# EAGLE design DAC_GainOutputStage6 (EAGLE 9.6.2)
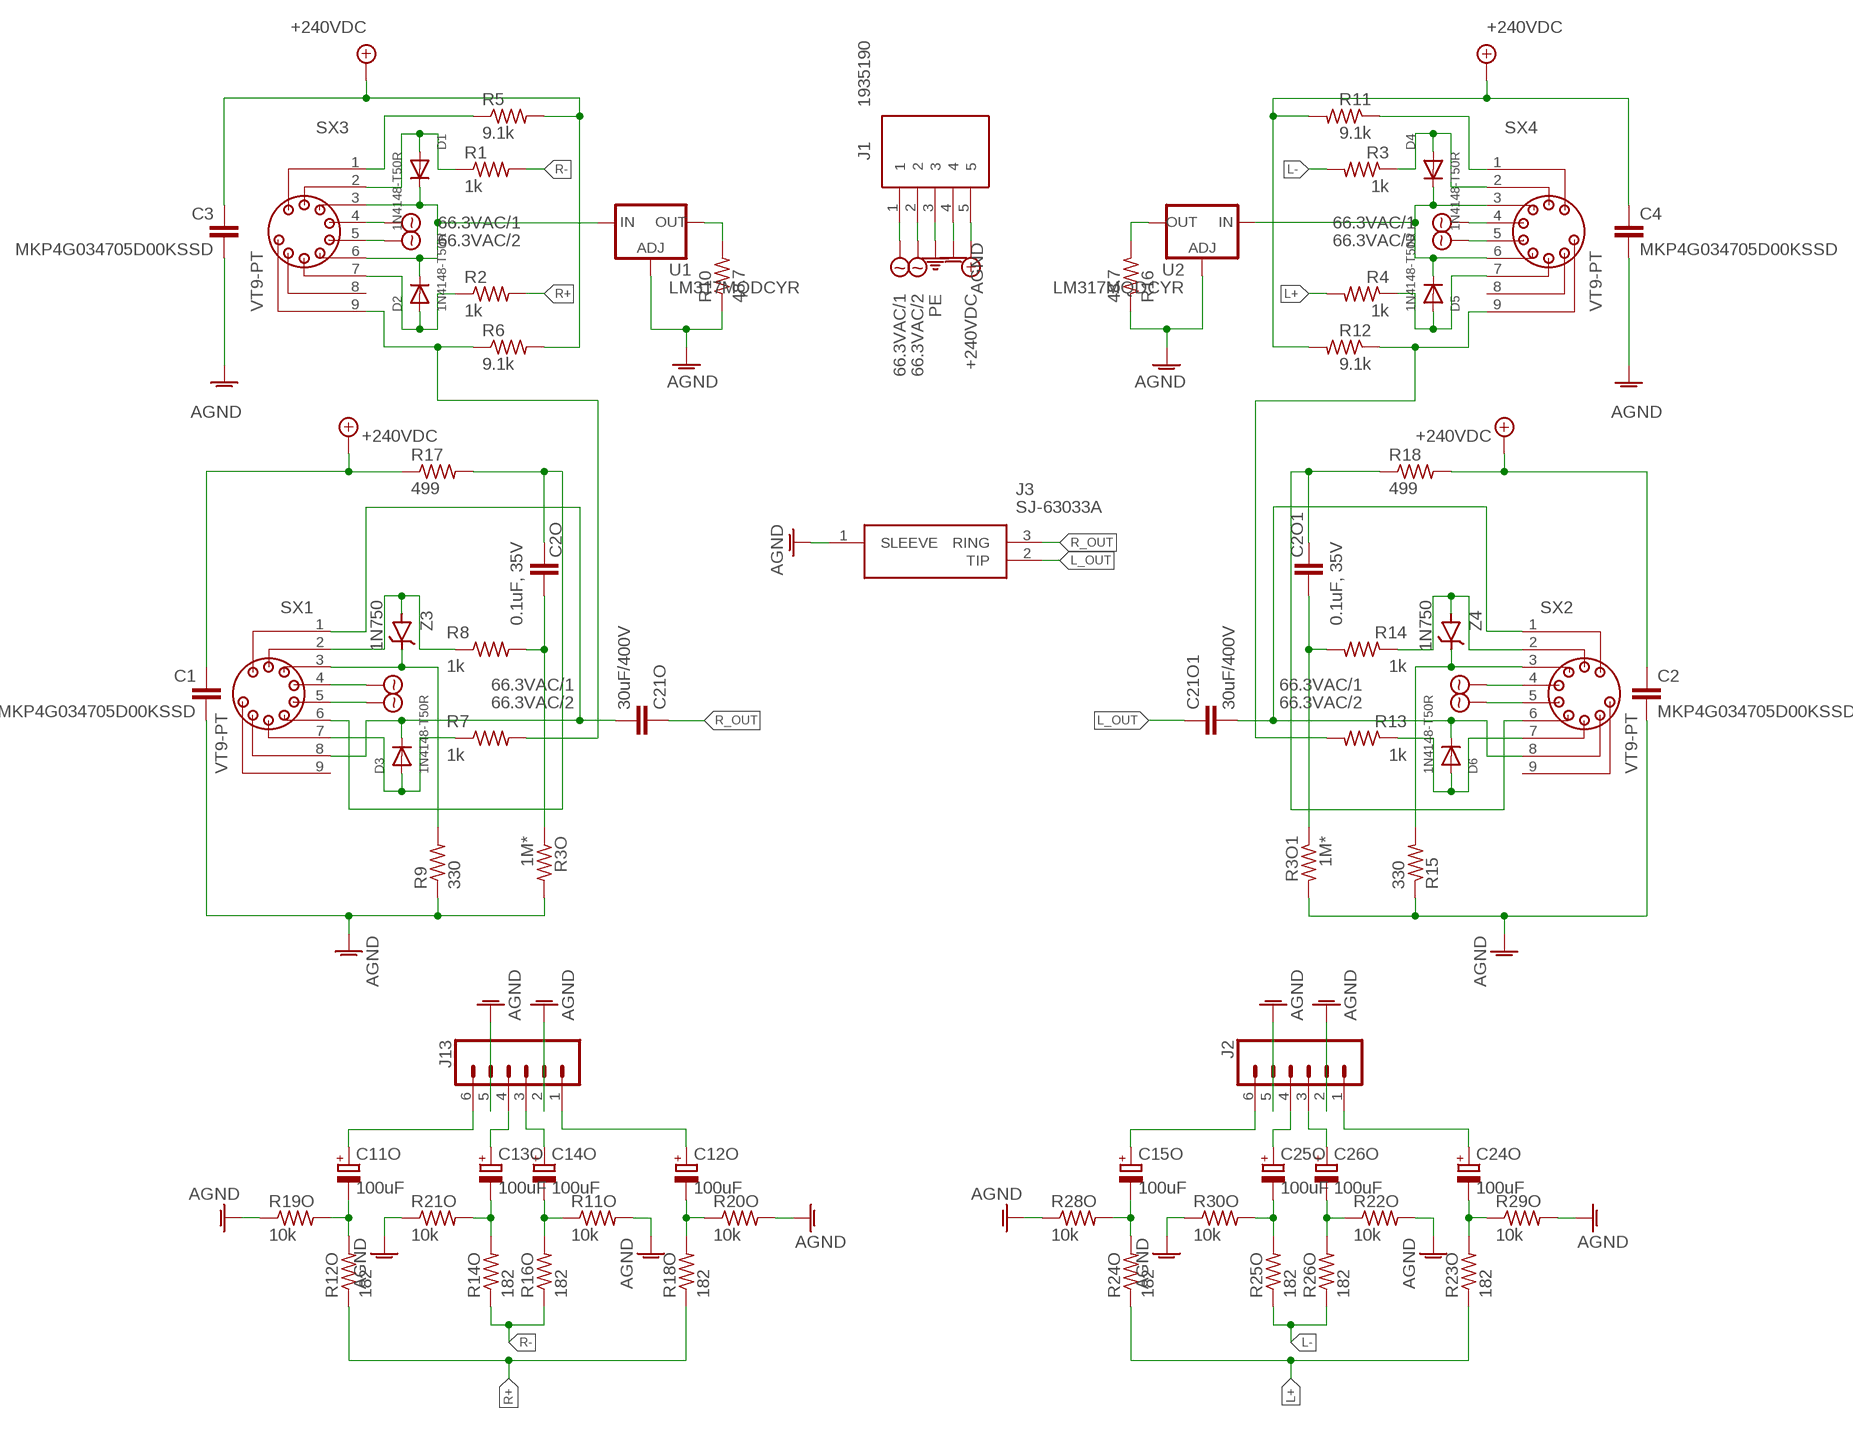
[diagram p0: schematic, sheet 1]

## Parts
C1  MKP4G034705D00KSSD  [MKP4G034705D00KSSD]
C2  MKP4G034705D00KSSD  [MKP4G034705D00KSSD]
C2O  0.1uF, 35V  MKS4B031002A00JC00  [MKS4B031002A00JC00]
C2O1  0.1uF, 35V  MKS4B031002A00JC00  [MKS4B031002A00JC00]
C3  MKP4G034705D00KSSD  [MKP4G034705D00KSSD]
C4  MKP4G034705D00KSSD  [MKP4G034705D00KSSD]
C11O  100uF  UFW1H101MPD1TD  [CAPPRD350W60D825H1300]
C12O  100uF  UFW1H101MPD1TD  [CAPPRD350W60D825H1300]
C13O  100uF  UFW1H101MPD1TD  [CAPPRD350W60D825H1300]
C14O  100uF  UFW1H101MPD1TD  [CAPPRD350W60D825H1300]
C15O  100uF  UFW1H101MPD1TD  [CAPPRD350W60D825H1300]
C21O  30uF/400V  DCP4G053006ID2KSSD  [DCP4G053006ID2KSSD]
C21O1  30uF/400V  DCP4G053006ID2KSSD  [DCP4G053006ID2KSSD]
C24O  100uF  UFW1H101MPD1TD  [CAPPRD350W60D825H1300]
C25O  100uF  UFW1H101MPD1TD  [CAPPRD350W60D825H1300]
C26O  100uF  UFW1H101MPD1TD  [CAPPRD350W60D825H1300]
D1  1N4148-T50R  [DIOAD1068W53L380D172]
D2  1N4148-T50R  [DIOAD1068W53L380D172]
D3  1N4148-T50R  [DIOAD1068W53L380D172]
D4  1N4148-T50R  [DIOAD1068W53L380D172]
D5  1N4148-T50R  [DIOAD1068W53L380D172]
D6  1N4148-T50R  [DIOAD1068W53L380D172]
J1  1935190  [1935190]
J2  CONN_06SILK_FEMALE_PTH  [1X06]
J3  SJ-63033A  [SJ63033A]
J13  CONN_06SILK_FEMALE_PTH  [1X06]
R1  1k  LR1F1K0  [0207/10]
R2  1k  LR1F1K0  [0207/10]
R3  1k  LR1F1K0  [0207/10]
R3O  1M*  LR1F1M0  [0207/10]
R3O1  1M*  LR1F1M0  [0207/10]
R4  1k  LR1F1K0  [0207/10]
R5  9.1k  PR02000209101FA100  [0411/15]
R6  9.1k  PR02000209101FA100  [0411/15]
R7  1k  LR1F1K0  [0207/10]
R8  1k  LR1F1K0  [0207/10]
R9  330  LR1F330R  [0207/10]
R10  48.7  RN55D48R7FB14  [0207/10]
R11  9.1k  PR02000209101FA100  [0411/15]
R11O  10k  LR1F10K  [0207/10]
R12  9.1k  PR02000209101FA100  [0411/15]
R12O  182  MF0207FTE52-182R  [0207/10]
R13  1k  LR1F1K0  [0207/10]
R14  1k  LR1F1K0  [0207/10]
R14O  182  MF0207FTE52-182R  [0207/10]
R15  330  LR1F330R  [0207/10]
R16  48.7  RN55D48R7FB14  [0207/10]
R16O  182  MF0207FTE52-182R  [0207/10]
R17  499  PR02000204990FA100  [0411/15]
R18  499  PR02000204990FA100  [0411/15]
R18O  182  MF0207FTE52-182R  [0207/10]
R19O  10k  LR1F10K  [0207/10]
R20O  10k  LR1F10K  [0207/10]
R21O  10k  LR1F10K  [0207/10]
R22O  10k  LR1F10K  [0207/10]
R23O  182  MF0207FTE52-182R  [0207/10]
R24O  182  MF0207FTE52-182R  [0207/10]
R25O  182  MF0207FTE52-182R  [0207/10]
R26O  182  MF0207FTE52-182R  [0207/10]
R28O  10k  LR1F10K  [0207/10]
R29O  10k  LR1F10K  [0207/10]
R30O  10k  LR1F10K  [0207/10]
SX1  VT9-PT  [VT9-PT]
SX2  VT9-PT  [VT9-PT]
SX3  VT9-PT  [VT9-PT]
SX4  VT9-PT  [VT9-PT]
U1  LM317MQDCYR  [SOT230P700X180-4N]
U2  LM317MQDCYR  [SOT230P700X180-4N]
Z3  1N750  [DIOAD1256W56L444D203]
Z4  1N750  [DIOAD1256W56L444D203]

## Nets
66.3VAC/1 [Power]: J1.1 SX1.4 SX2.4 SX3.4 SX4.4
66.3VAC/2 [Power]: J1.2 SX1.5 SX2.5 SX3.5 SX4.5
+240VDC [Power]: C1.1 C2.1 C3.1 C4.1 J1.5 R5.2 R6.2 R11.2 R12.2 R17.1 R18.2
AGND [Power]: C1.2 C2.2 C3.2 C4.2 J1.4 J2.2 J2.5 J3.1(SLEEVE) J13.2 J13.5 R3O1.2 R3O.2 R9.1 R10.1 R11O.2 R15.1 R16.1 R19O.1 R20O.2 R21O.1 R22O.2 R28O.1 R29O.2 R30O.1 U1.1(ADJ) U2.1(ADJ)
L+ [Signal]: R4.2 R23O.1 R24O.1
L- [Signal]: R3.2 R25O.1 R26O.1
L_OUT [Signal]: C21O1.1 J3.2(TIP)
N$1: R6.1 R7.2 SX3.9
N$2: R8.1 SX1.2 Z3.2(A)
N$3: C21O1.2 D6.1(C) SX2.1 SX2.8
N$4: D4.2(A) R3.1 SX4.2
N$5: D5.2(A) R4.1 SX4.7
N$6: D1.2(A) R1.1 SX3.2
N$7 [Power]: D4.1(C) D5.1(C) SX4.3 SX4.6 U2.3(IN)
N$8: R11.1 SX4.1
N$9: R12.1 R13.2 SX4.9
N$10: C11O.1(+) J13.6
N$11: C11O.2(-) R12O.2 R19O.2
N$12: C15O.1(+) J2.6
N$13: D2.2(A) R2.1 SX3.7
N$14: R14.1 SX2.2 Z4.2(A)
N$15: C12O.1(+) J13.1
N$16: C2O.2 R3O.1 R8.2
N$17: C2O1.2 R3O1.1 R14.2
N$18: C21O.2 D3.1(C) SX1.1 SX1.8
N$19: C12O.2(-) R18O.2 R20O.1
N$20: C15O.2(-) R24O.2 R28O.2
N$21: C13O.1(+) J13.4
N$22 [Power]: D1.1(C) D2.1(C) SX3.3 SX3.6 U1.3(IN)
N$23: D3.2(A) R7.1 SX1.7
N$24: C14O.1(+) J13.3
N$25: C14O.2(-) R11O.1 R16O.2
N$26: R9.2 SX1.3 Z3.1(C)
N$27: R15.2 SX2.3 Z4.1(C)
N$28: C13O.2(-) R14O.2 R21O.2
N$29: D6.2(A) R13.1 SX2.7
N$30: C24O.1(+) J2.1
N$31: C24O.2(-) R23O.2 R29O.1
N$32: C25O.1(+) J2.4
N$33: C26O.1(+) J2.3
N$34: C26O.2(-) R22O.1 R26O.2
N$35: R5.1 SX3.1
N$36: C25O.2(-) R25O.2 R30O.2
N$37: R10.2 U1.2(OUT) U1.4(OUT)
N$38: R16.2 U2.2(OUT) U2.4(OUT)
N$39 [Power]: C2O.1 R17.2 SX1.6
N$40 [Power]: C2O1.1 R18.1 SX2.6
PE [Power]: J1.3
R+ [Signal]: R2.2 R12O.1 R18O.1
R- [Signal]: R1.2 R14O.1 R16O.1
R_OUT [Signal]: C21O.1 J3.3(RING)
Unconnected: SX1.9 SX2.9 SX3.8 SX4.8

## Library data of the parts
C1-C4 = Dual Mono Amp Library:MKP4G034705D00KSSD: 0.47 F Film Capacitor 220V 400V Polypropylene (PP), Metallized Radial Source: Datasheet <https://www.wima.de/wp-content/uploads/media/e_WIMA_MKP_4.pdf>; DESCRIPTION: 0.47 F Film Capacitor 220V 400V Polypropylene (PP), Metallized Radial; HEIGHT: 16.5mm; MANUFACTURER_NAME: WIMA; MANUFACTURER_PART_NUMBER: MKP4G034705D00KSSD; MOUSER_PART_NUMBER: 505-MKP4G034705DKSSD; MOUSER_PRICE-STOCK: http://www.mouser.com/Search/ProductDetail.aspx?qs=sJjjjplDs9uaOctv9bTMfA%3d%3d
C2O C2O1 = Dual Mono Amp Library:MKS4B031002A00JC00: Film Capacitors MKS 4 0.1 uF 50 VDC 2.5x7x10 PCM 7.5 Source: Datasheet <https://www.wima.de/wp-content/uploads/media/e_WIMA_MKS_4.pdf>; DESCRIPTION: Film Capacitors MKS 4 0.1 uF 50 VDC 2.5x7x10 PCM 7.5; HEIGHT: 7mm; MANUFACTURER_NAME: WIMA; MANUFACTURER_PART_NUMBER: MKS4B031002A00JC00; MOUSER_PART_NUMBER: 505-MKS4B0312AJC; MOUSER_PRICE-STOCK: https://www.mouser.co.uk/ProductDetail/WIMA/MKS4B031002A00JC00?qs=2G4irm%2FqADy9MV8AUfKNYA%3D%3D
C11O C12O C13O C14O C15O C24O C25O C26O = Dual Mono Amp Library:UFW1H101MPD1TD: Aluminum Electrolytic Capacitors - Radial Leaded 100uF 50 Volts 20% Source: Datasheet <https://www.nichicon.co.jp/english/series_items/catalog_pdf/e-ufw.pdf>; ARROW_PART_NUMBER: UFW1H101MPD1TD; ARROW_PRICE-STOCK: https://www.arrow.com/en/products/ufw1h101mpd1td/nichicon; DESCRIPTION: Aluminum Electrolytic Capacitors - Radial Leaded 100uF 50 Volts 20%; HEIGHT: 13mm; MANUFACTURER_NAME: Nichicon; MANUFACTURER_PART_NUMBER: UFW1H101MPD1TD; MOUSER_PART_NUMBER: 647-UFW1H101MPD1TD; MOUSER_PRICE-STOCK: https://www.mouser.co.uk/ProductDetail/Nichicon/UFW1H101MPD1TD?qs=WJSLByB5Mu30jPPJ2KiG3A%3D%3D
C21O C21O1 = Dual Mono Amp Library:DCP4G053006ID2KSSD: Film Capacitors DC-LINK MKP 4 30.0 uF 400 VDC 17x34.5x31.5 PCM 27.5 Source: Datasheet <https://www.wima.de/wp-content/uploads/media/e_WIMA_DC_Link_MKP_4.pdf>; DESCRIPTION: Film Capacitors DC-LINK MKP 4 30.0 uF 400 VDC 17x34.5x31.5 PCM 27.5; HEIGHT: 34.5mm; MANUFACTURER_NAME: WIMA; MANUFACTURER_PART_NUMBER: DCP4G053006ID2KSSD; MOUSER_PART_NUMBER: 505-DCP4G0536ID2KSSD; MOUSER_PRICE-STOCK: https://www.mouser.co.uk/ProductDetail/WIMA/DCP4G053006ID2KSSD?qs=RB4whv9F6rwxZ2Ey0tRejg%3D%3D
D1-D6 = Dual Mono Amp Library:1N4148-T50R: Diodes - General Purpose, Power, Switching Hi Conductance Fast Source: Datasheet <https://www.onsemi.com/pub/Collateral/1N914-D.PDF>; DESCRIPTION: Diodes - General Purpose, Power, Switching Hi Conductance Fast; HEIGHT: mm; MANUFACTURER_NAME: onsemi; MANUFACTURER_PART_NUMBER: 1N4148-T50R; MOUSER_PART_NUMBER: 512-1N4148T50R; MOUSER_PRICE-STOCK: https://www.mouser.co.uk/ProductDetail/onsemi-Fairchild/1N4148-T50R?qs=0lQeLiL1qyZS6rosZp7Ehg%3D%3D
J1 = Dual Mono Amp Library:1935190: PCB terminal block, nominal current: 17.5 A, rated voltage (III/2): 400 V, nominal cross section: 1.5 mm?, Number of potentials: 5, Number of rows: 1, Number of positions per row: 5, product range: PT 1,5/..-H, pitch: 5 mm, connection method: Screw connection with wire protector, mounting: Wave soldering, conductor/PCB connection direction: 0 ?, color: green, Pin layout: Linear pinning, Solder pin [P]: 3.5 mm, type of packaging: packed in cardboard Source: Datasheet <https://www.phoenixcontact.com/online/portal/us/pxc/product_detail_page/!ut/p/z1/3Vdbc5pAFP4r5sG3rLsLLEJn-oDGlJjEYsQqvDDssma24RZETf31Xbyk1Wn1IeN0CnNm2D2c853L8jEc6MMp9NNwKZ7DUmRpGMu95-uB23F7PUfR8dch6aC7G9LtPWhP2B4o8Bv0oV-GFHq4WsWCFmHxA3qLOU8rRS4i-chUCTZRtc>; DESCRIPTION: PCB terminal block, nominal current: 17.5 A, rated voltage (III/2): 400 V, nominal cross section: 1.5 mm?, Number of potentials: 5, Number of rows: 1, Number of positions per row: 5, product range: PT 1,5/..-H, pitch: 5 mm, connection method: Screw connection with wire protector, mounting: Wave soldering, conductor/PCB connection direction: 0 ?, color: green, Pin layout: Linear pinning, Solder pin [P]: 3.5 mm, type of packaging: packed in cardboard; HEIGHT: 11.55mm; MANUFACTURER_NAME: Phoenix Contact; MANUFACTURER_PART_NUMBER: 1935190; MOUSER_PART_NUMBER: 651-1935190; MOUSER_PRICE-STOCK: https://www.mouser.co.uk/ProductDetail/Phoenix-Contact/1935190?qs=QWULklcAmSS%2FS46GSzyZOw%3D%3D
J2 J13 = Dual Mono Amp Library:CONN_06: Multi connection point. Often used as Generic Header-pin footprint for 0.1 inch spaced/style header connections On any of the 0.1 inch spaced packages, you can populate with these: Break Away Headers - Straight <https://www.sparkfun.com/products/116> (PRT-00116) Break Away Male Headers - Right Angle <https://www.sparkfun.com/products/553> (PRT-00553) Female Headers <https://www.sparkfun.com/products/115> (PRT-00115) Break Away Headers - Machine Pin <https://www.sparkfun.com/products/117> (PRT-00117) Break Away Female Headers - Swiss Machine Pin <https://www.sparkfun.com/products/743> (PRT-00743) Arduino Stackable Header - 6 Pin <https://www.sparkfun.com/products/9280> (PRT-09280) Screw Terminals 2.54mm Pitch (6-Pin) <https://www.sparkfun.com/products/16499> (PRT-16499) For SCREWTERMINALS and SPRING TERMINALS visit here: Screw Terimnals on SparkFun.com <https://www.sparkfun.com/search/results?term=Screw+Terminals> (5mm/3.5mm/2.54mm spacing) This device is also useful as a general connection point to wire up your design to another part of your project. Our various solder wires solder well into these plated through hole pads. Hook-Up Wire - Assortment (Stranded, 22 AWG) <https://www.sparkfun.com/products/11375> (PRT-11375) Hook-Up Wire - Assortment (Solid Core, 22 AWG) <https://www.sparkfun.com/products/11367> (PRT-11367) View the entire wire category on our website here <https://www.sparkfun.com/categories/141>; PROD_ID: CONN-08437
J3 = Dual Mono Amp Library:SJ-63033A: 6.35 mm, Stereo, Right Angle, Through Hole Mount, 3 Conductors, 0 Internal Switches, Audio Jack Connector Source: Datasheet <https://www.cuidevices.com/product/resource/sj-63033a.pdf>; DESCRIPTION: 6.35 mm, Stereo, Right Angle, Through Hole Mount, 3 Conductors, 0 Internal Switches, Audio Jack Connector; HEIGHT: 12.3mm; MANUFACTURER_NAME: CUI Devices; MANUFACTURER_PART_NUMBER: SJ-63033A
R1-R4 R7 R8 R13 R14 = Dual Mono Amp Library:LR1F1K0: Body Features: Lead Type Axial-Leaded | Configuration Features: Number of Resistors 1 | Dimensions: Passive Component Dimensions 6.2 x 2.3 MM | Electrical Characteristics: Passive Component Tolerance 1 PCT | Resistance Value 1K OHM | Operating Voltage 350 V | Power Rating .6 WATT | Resistance Class 1k 1M | Packaging Features: Packaging Method Ammo Packed | Product Type Features: Element Type Thin Film | Resistor Type General Purpose Resistor | Termination Features: Termination Area Base Material Cop Source: Datasheet <https://www.te.com/commerce/DocumentDelivery/DDEController?Action=srchrtrv&DocNm=1773241&DocType=Data Sheet&DocLang=English&PartCntxt=1622349-1&DocFormat=pdf>; DESCRIPTION: Body Features: Lead Type Axial-Leaded | Configuration Features: Number of Resistors 1 | Dimensions: Passive Component Dimensions 6.2 x 2.3 MM | Electrical Characteristics: Passive Component Tolerance 1 PCT | Resistance Value 1K OHM | Operating Voltage 350 V | Power Rating .6 WATT | Resistance Class 1k 1M | Packaging Features: Packaging Method Ammo Packed | Product Type Features: Element Type Thin Film | Resistor Type General Purpose Resistor | Termination Features: Termination Area Base Material Cop; HEIGHT: mm; MANUFACTURER_NAME: TE Connectivity; MANUFACTURER_PART_NUMBER: LR1F1K0; MOUSER_PART_NUMBER: 279-LR1F1K0; MOUSER_PRICE-STOCK: https://www.mouser.co.uk/ProductDetail/TE-Connectivity-Holsworthy/LR1F1K0?qs=ip69W3eHERVhMxNSZkerTg%3D%3D
R3O R3O1 = Dual Mono Amp Library:LR1F1M0: TE Connectivity Axial Metal Film Resistor 1m +/-1% 0.6W +/-50ppm/C Source: Datasheet <https://www.te.com/commerce/DocumentDelivery/DDEController?Action=showdoc&DocId=Data Sheet1773241GpdfEnglishENG_DS_1773241_G.pdf1622367-1>; DESCRIPTION: TE Connectivity Axial Metal Film Resistor 1m +/-1% 0.6W +/-50ppm/C; HEIGHT: mm; MANUFACTURER_NAME: TE Connectivity; MANUFACTURER_PART_NUMBER: LR1F1M0; MOUSER_PART_NUMBER: 279-LR1F1M0; MOUSER_PRICE-STOCK: https://www.mouser.co.uk/ProductDetail/TE-Connectivity-Holsworthy/LR1F1M0?qs=ip69W3eHERVt%2FmQVAugcSg%3D%3D
R5 R6 R11 R12 = Dual Mono Amp Library:PR02000209101FA100: VISHAY - PR02000209101FA100 - Through Hole Resistor, 9.1 kohm, PR02 Series, 2 W, +/- 5%, Axial Leaded, 500 V Source: Datasheet <https://www.vishay.com/doc?28729>; DESCRIPTION: VISHAY - PR02000209101FA100 - Through Hole Resistor, 9.1 kohm, PR02 Series, 2 W, +/- 5%, Axial Leaded, 500 V; HEIGHT: mm; MANUFACTURER_NAME: Vishay; MANUFACTURER_PART_NUMBER: PR02000209101FA100; MOUSER_PART_NUMBER: 594-PR02000209101FA1; MOUSER_PRICE-STOCK: https://www.mouser.com/ProductDetail/Vishay-BC-Components/PR02000209101FA100?qs=sGAEpiMZZMtlubZbdhIBILAdz%2F2y2rDs5x9O1ZBVKlg%3D
R9 R15 = Dual Mono Amp Library:LR1F330R: Body Features: Lead Type Axial-Leaded | Configuration Features: Number of Resistors 1 | Dimensions: Passive Component Dimensions 6.2 x 2.3 MM | Electrical Characteristics: Resistance Value 330 OHM | Power Rating .6 WATT | Passive Component Tolerance 1 PCT | Operating Voltage 350 V | Resistance Class Up to 1k | Packaging Features: Packaging Method Ammo Packed | Product Type Features: Resistor Type General Purpose Resistor | Element Type Thin Film | Termination Features: Number of Terminations 2 | Terminati Source: Datasheet <https://www.te.com/commerce/DocumentDelivery/DDEController?Action=srchrtrv&DocNm=1773241&DocType=Data Sheet&DocLang=English&PartCntxt=1622438-1&DocFormat=pdf>; DESCRIPTION: Body Features: Lead Type Axial-Leaded | Configuration Features: Number of Resistors 1 | Dimensions: Passive Component Dimensions 6.2 x 2.3 MM | Electrical Characteristics: Resistance Value 330 OHM | Power Rating .6 WATT | Passive Component Tolerance 1 PCT | Operating Voltage 350 V | Resistance Class Up to 1k | Packaging Features: Packaging Method Ammo Packed | Product Type Features: Resistor Type General Purpose Resistor | Element Type Thin Film | Termination Features: Number of Terminations 2 | Terminati; HEIGHT: mm; MANUFACTURER_NAME: TE Connectivity; MANUFACTURER_PART_NUMBER: LR1F330R; MOUSER_PART_NUMBER: 279-LR1F330R; MOUSER_PRICE-STOCK: https://www.mouser.co.uk/ProductDetail/TE-Connectivity-Holsworthy/LR1F330R?qs=ip69W3eHERU18wOSJKTVaQ%3D%3D
R10 R16 = Dual Mono Amp Library:RN55D48R7FB14: Metal Film Resistors - Through Hole 1/8watt 48.7ohms 1% 100ppm Source: Datasheet <https://www.vishay.com/doc?31027>; DESCRIPTION: Metal Film Resistors - Through Hole 1/8watt 48.7ohms 1% 100ppm; HEIGHT: mm; MANUFACTURER_NAME: Vishay; MANUFACTURER_PART_NUMBER: RN55D48R7FB14; MOUSER_PART_NUMBER: 71-RN55D-F-48.7; MOUSER_PRICE-STOCK: https://www.mouser.com/ProductDetail/Vishay-Dale/RN55D48R7FB14?qs=sGAEpiMZZMsPqMdJzcrNwqLSjlxN7Le6H%2Fnooot2Cxw%3D
R11O R19O R20O R21O R22O R28O R29O R30O = Dual Mono Amp Library:LR1F10K: Metal film resistor, 10K 0.6W TE Connectivity LR1F Series Axial Metal Film Resistor 10k Source: Datasheet <https://datasheet.datasheetarchive.com/originals/distributors/DKDS-21/401716.pdf>; DESCRIPTION: Metal film resistor, 10K 0.6W TE Connectivity LR1F Series Axial Metal Film Resistor 10k; HEIGHT: mm; MANUFACTURER_NAME: TE Connectivity; MANUFACTURER_PART_NUMBER: LR1F10K; MOUSER_PART_NUMBER: 279-LR1F10K; MOUSER_PRICE-STOCK: https://www.mouser.co.uk/ProductDetail/TE-Connectivity-Holsworthy/LR1F10K?qs=ip69W3eHERWDLLWs2Qv0Lg%3D%3D
R12O R14O R16O R18O R23O R24O R25O R26O = Dual Mono Amp Library:MF0207FTE52-182R: Metal Film Resistors - Through Hole 0.6W 1% 182 ohm 50pp m Source: Datasheet <https://www.mouser.com/datasheet/2/447/YAGEO_MF0_datasheet_2021v1-3003020.pdf>; DESCRIPTION: Metal Film Resistors - Through Hole 0.6W 1% 182 ohm 50pp m; HEIGHT: mm; MANUFACTURER: Yageo; MANUFACTURER_PART_NUMBER: MF0207FTE52-182R; MOUSER_PART_NUMBER: 603-MF0207FTE52-182R; MOUSER_PRICE-STOCK: https://www.mouser.com/ProductDetail/YAGEO/MF0207FTE52-182R?qs=KUIzHt%2Fe91leK267FaM40g%3D%3D
R17 R18 = Dual Mono Amp Library:PR02000204990FA100: VISHAY - PR02000204990FA100 - Through Hole Resistor, 499 ohm, PR02 Series, 2 W, +/- 5%, Axial Leaded, 500 V Source: Datasheet <https://www.vishay.com/doc?28729>; DESCRIPTION: VISHAY - PR02000204990FA100 - Through Hole Resistor, 499 ohm, PR02 Series, 2 W, +/- 5%, Axial Leaded, 500 V; HEIGHT: mm; MANUFACTURER_NAME: Vishay; MANUFACTURER_PART_NUMBER: PR02000204990FA100; MOUSER_PART_NUMBER: 594-PR02000204990FA1; MOUSER_PRICE-STOCK: https://www.mouser.com/ProductDetail/Vishay-BC-Components/PR02000204990FA100?qs=bTzheeSci6S93b9bbmXKjA%3D%3D
SX1-SX4 = Dual Mono Amp Library:VT9: VACUUM TUBE SOCKET Source: 00004280-VT9-PT.pdf
U1 U2 = Dual Mono Amp Library:LM317MQDCYR: Standard Regulator 1.25V to 37V 0.5A Texas Instruments LM317MQDCYR, Single Linear Voltage Regulator, 500mA Adjustable 1.25 37 V, 4-Pin SOT-223 Source: Datasheet <https://componentsearchengine.com/Datasheets/2/LM317MQDCYR.pdf>; DESCRIPTION: Standard Regulator 1.25V to 37V 0.5A Texas Instruments LM317MQDCYR, Single Linear Voltage Regulator, 500mA Adjustable 1.25 37 V, 4-Pin SOT-223; HEIGHT: 1.8mm; MANUFACTURER_NAME: Texas Instruments; MANUFACTURER_PART_NUMBER: LM317MQDCYR; MOUSER_PART_NUMBER: 595-LM317MQDCYR; MOUSER_PRICE-STOCK: https://www.mouser.co.uk/ProductDetail/Texas-Instruments/LM317MQDCYR?qs=VBduBm9rCJSAPGr9YDjocQ%3D%3D
Z3 Z4 = Dual Mono Amp Library:1N750: Zener Diodes Voltage Regulator Source: Datasheet <https://www.microsemi.com/document-portal/doc_view/10928-sa5-7-datasheet>; DESCRIPTION: Zener Diodes Voltage Regulator; HEIGHT: mm; MANUFACTURER_NAME: Microsemi Corporation; MANUFACTURER_PART_NUMBER: 1N750; MOUSER_PART_NUMBER: 494-1N750(DO-35); MOUSER_PRICE-STOCK: https://www.mouser.co.uk/ProductDetail/Microchip-Microsemi/1N750?qs=Xwz%252BGKGy4sB1rzIdx4SmVg%3D%3D

## Net classes
1 Signal: width 1.27 mm
2 Power: width 2.54 mm

## Board
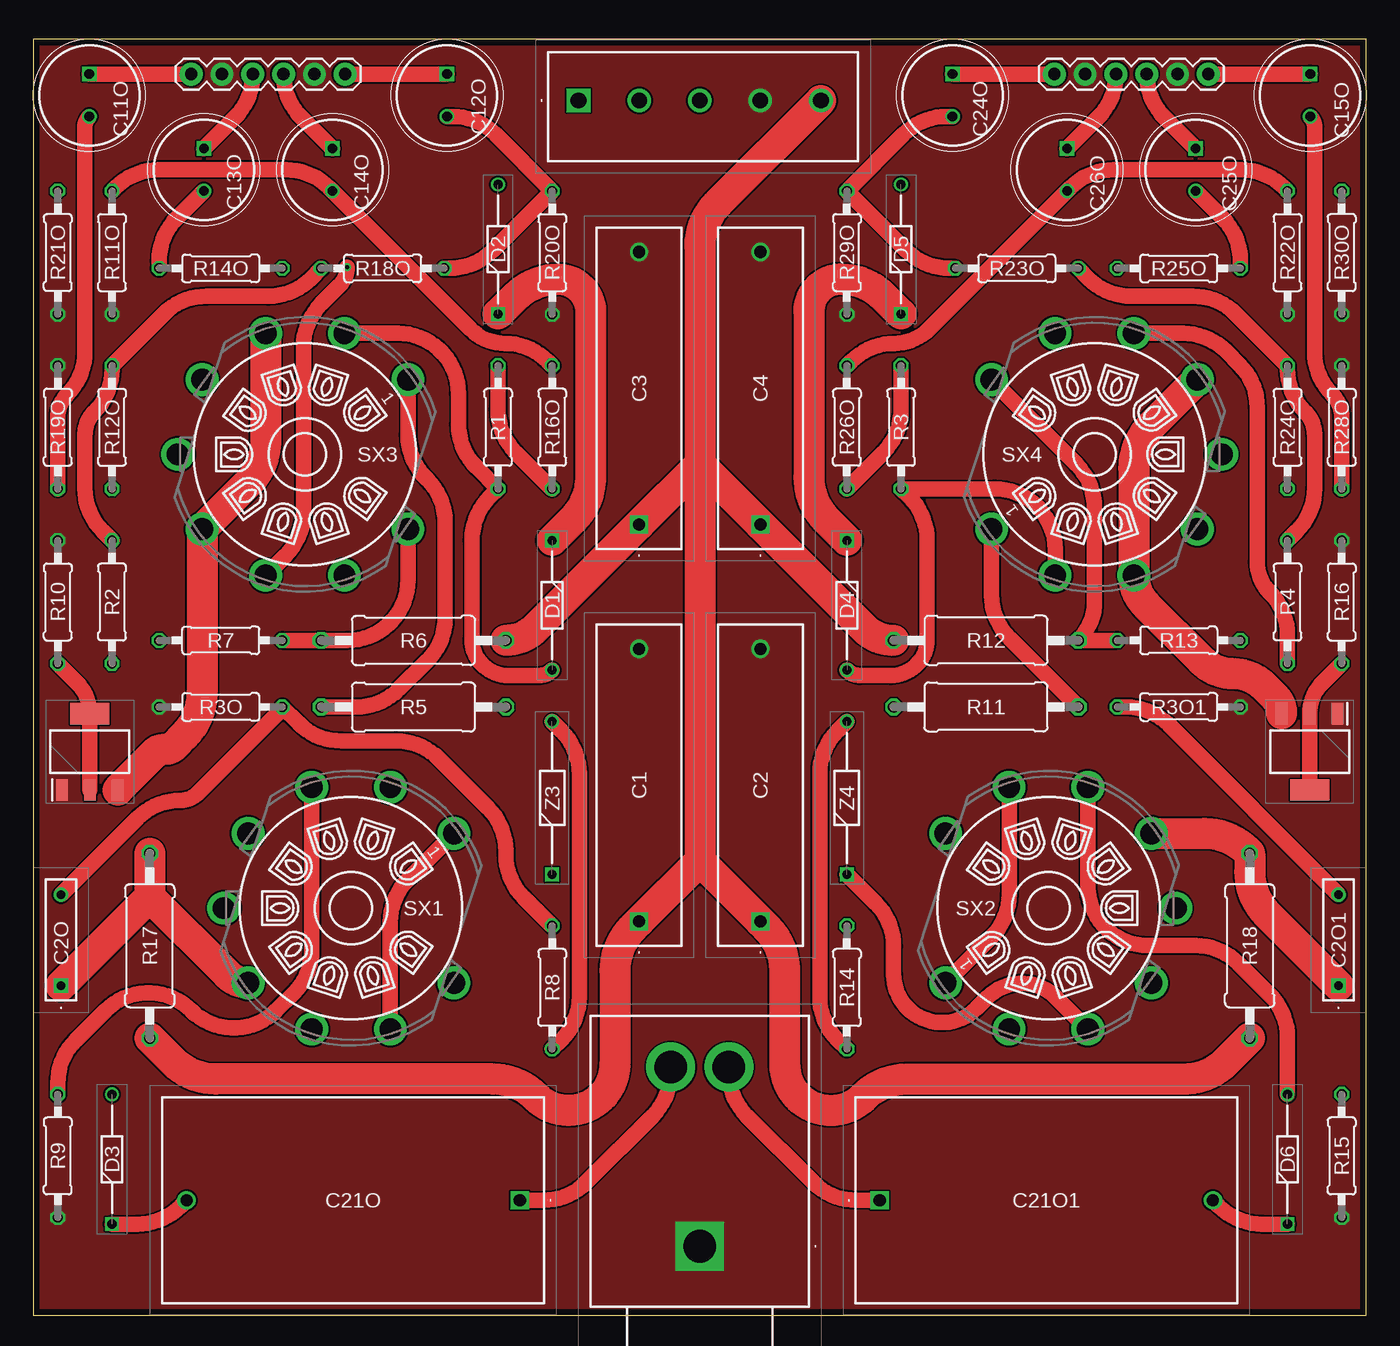
[diagram p1: board, top side]
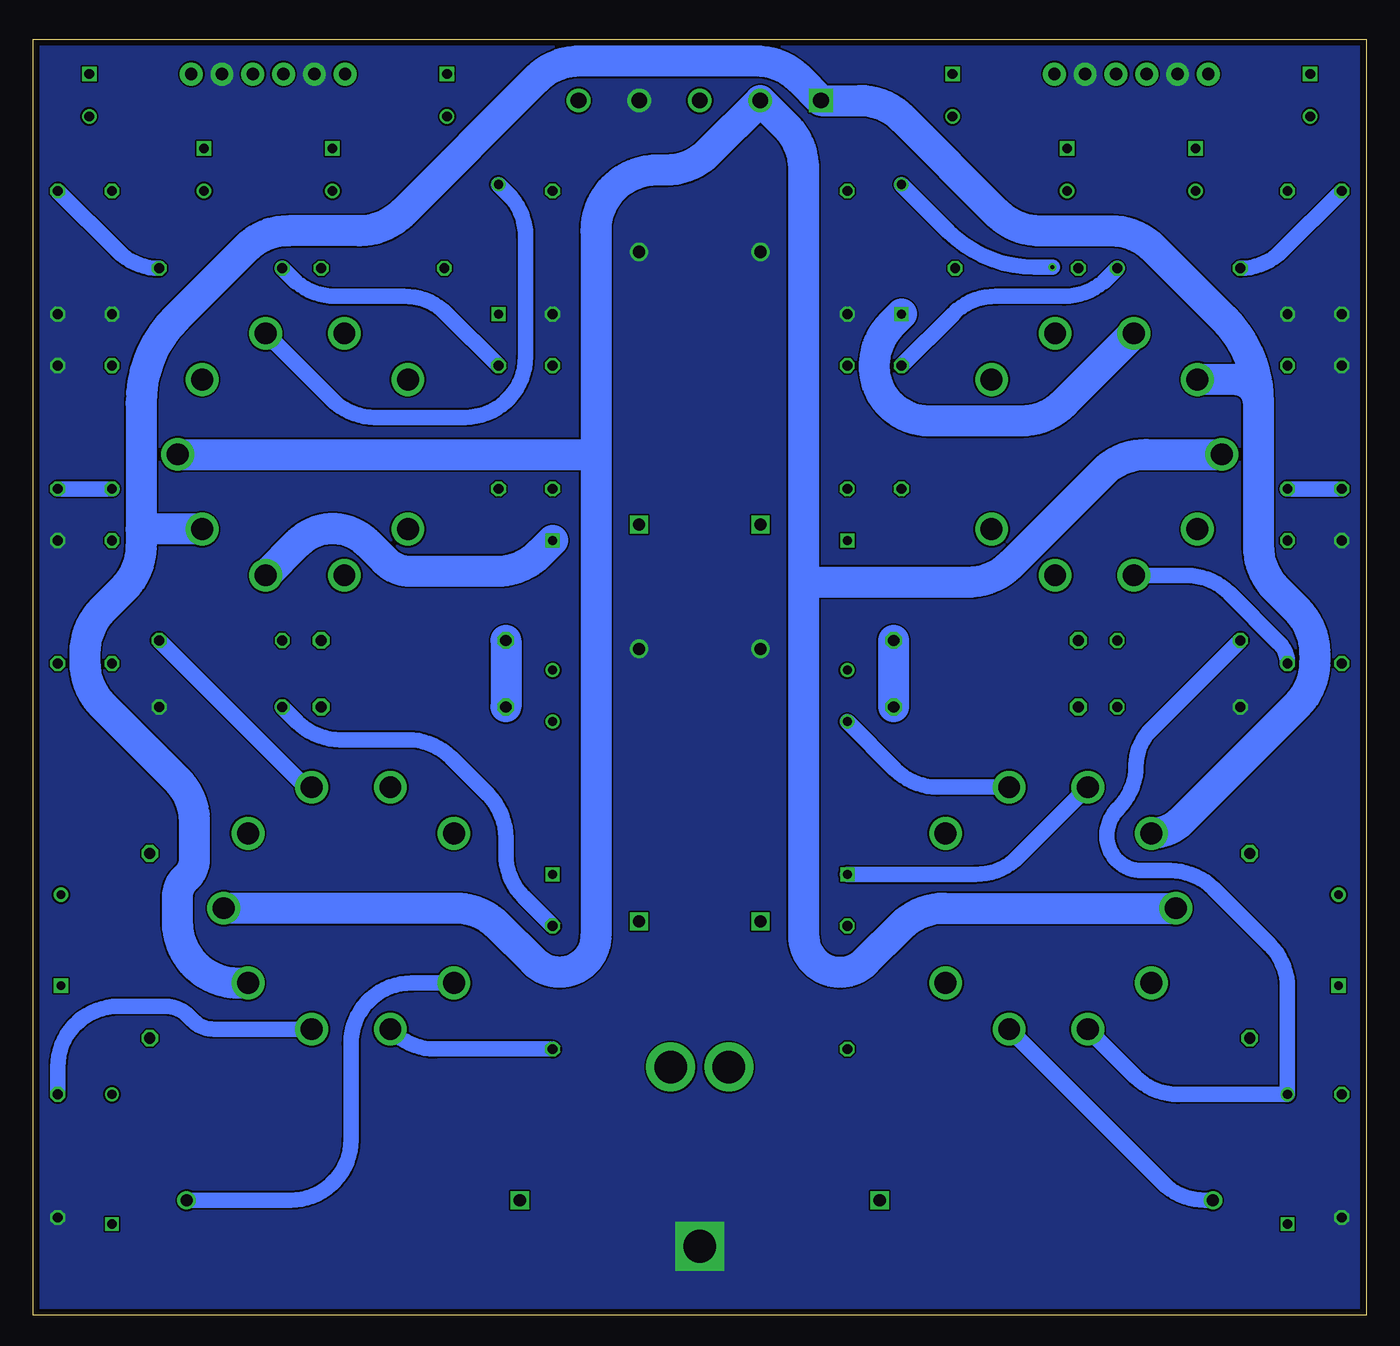
[diagram p2: board, bottom side, seen from below]

Size 110 x 105.3 mm. Coordinates in mm from the lower left corner, seen from the top.
Outline: 0,0 110,0 110,105.3 0,105.3 0,0
Copper layers (1*16): Top 0.035mm / dielectric 1.6mm / Bottom 0.035mm
Design rules "Elecrow_2-layer_PCB_eagle_rule": minimum track width 6mil, minimum drill 12mil, track to track 6mil, track to pad 6mil, pad to pad 6mil, via to via 8mil, smd to smd 0mil, copper to edge 20mil, drill to drill 10mil, minimum pad ring 6mil, minimum via ring 6mil, stop-mask expansion 0mil, vias tented up to drill 100mil, thermal gap 10mil

### Footprints (pad centres in the part's own frame; a part is rotated, then mirrored left to right if it is on the bottom)
MKP4G034705D00KSSD = drill 1 pad 1.5 square: 1 0,0 | drill 1 pad 1.5: 2 22.5,0
MKS4B031002A00JC00 = drill 0.7 pad 1.2 square: 1 0,0 | drill 0.7 pad 1.2: 2 7.5,0
CAPPRD350W60D825H1300 = drill 0.8 pad 1.2 square: 1 0,0 | drill 0.8 pad 1.2: 2 3.5,0
DCP4G053006ID2KSSD = drill 1 pad 1.5 square: 1 0,0 | drill 1 pad 1.5: 2 27.5,0
DIOAD1068W53L380D172 = drill 0.75 pad 1.15 square: 1 0,0 | drill 0.75 pad 1.15: 2 10.7,0
1935190 = drill 1.3 pad 1.95 square: 1 0,0 | drill 1.3 pad 1.95: 2 5,0; 3 10,0; 4 15,0; 5 20,0
1X06 = drill 1.016 pad 1.88: 1 0,0; 2 2.54,0; 3 5.08,0; 4 7.62,0; 5 10.16,0; 6 12.7,0
SJ63033A = drill 2.69 pad 4.035 square: 1 0,0 | drill 2.69 pad 4.035: 2 14.8,-2.4; 3 14.8,2.4
0207/10 = drill 0.813 octagon: 1 -5.08,0; 2 5.08,0
0411/15 = drill 0.914 octagon: 1 -7.62,0; 2 7.62,0
VT9-PT = drill 1.8 pad 2.4: 1 6.172,8.495; 2 0,10.5; 3 -6.172,8.495; 4 -9.986,3.245; 5 -9.986,-3.245; 6 -6.172,-8.495; 7 0,-10.5; 8 6.172,-8.495; 9 9.986,-3.244
SOT230P700X180-4N = smd 1.75 x 0.95: 1 -3.15,2.3; 2 -3.15,0; 3 -3.15,-2.3 | smd 1.75 x 3.2: 4 3.15,0
DIOAD1256W56L444D203 = drill 0.75 pad 1.15 square: 1 0,0 | drill 0.75 pad 1.15: 2 12.6,0

### Placement (x,y rotation side)
C1  50,32.5 90 top
C2  60,32.5 90 top
C2O  2.3,27.23 90 top
C2O1  107.7,27.23 90 top
C3  50,65.25 90 top
C4  60,65.25 90 top
C11O  4.62,102.42 270 top
C12O  34.15,102.42 270 top
C13O  14.08,96.28 270 top
C14O  24.69,96.28 270 top
C15O  105.38,102.42 270 top
C21O  40.15,9.5 180 top
C21O1  69.85,9.5 0 top
C24O  75.85,102.42 270 top
C25O  95.92,96.28 270 top
C26O  85.31,96.28 270 top
D1  42.83,63.95 270 top
D2  38.36,82.62 90 top
D3  6.5,7.54 90 top
D4  67.14,63.95 270 top
D5  71.61,82.62 90 top
D6  103.5,7.54 90 top
J1  45,100.25 0 top
J2  84.26,102.42 0 top
J3  55,5.7 90 top
J13  25.74,102.42 180 top
R1  38.36,73.28 90 top
R2  6.5,58.87 90 top
R3  71.61,73.28 90 top
R3O  15.48,50.2 180 top
R3O1  94.52,50.2 0 top
R4  103.5,58.87 90 top
R5  31.38,50.2 0 top
R6  31.38,55.7 0 top
R7  15.48,55.7 0 top
R8  42.83,27.05 90 top
R9  2.03,13.16 90 top
R10  2.03,58.87 270 top
R11  78.62,50.2 180 top
R11O  6.5,87.7 270 top
R12  78.62,55.7 180 top
R12O  6.5,73.28 270 top
R13  94.52,55.7 180 top
R14  67.14,27.05 90 top
R14O  15.48,86.4 180 top
R15  107.97,13.16 90 top
R16  107.97,58.87 270 top
R16O  42.83,73.28 90 top
R17  9.62,30.5 90 top
R18  100.38,30.5 270 top
R18O  28.84,86.4 0 top
R19O  2.03,73.28 270 top
R20O  42.83,87.7 270 top
R21O  2.03,87.7 90 top
R22O  103.5,87.7 270 top
R23O  81.16,86.4 180 top
R24O  103.5,73.28 270 top
R25O  94.52,86.4 0 top
R26O  67.14,73.28 90 top
R28O  107.97,73.28 270 top
R29O  67.14,87.7 270 top
R30O  107.97,87.7 90 top
SX1  26.22,33.6 342 top
SX2  83.78,33.6 162 top
SX3  22.43,71.05 342 top
SX4  87.57,71.05 162 top
U1  4.67,46.5 90 top
U2  105.33,46.5 270 top
Z3  42.83,36.39 90 top
Z4  67.14,36.39 90 top

### Tracks (layer width: path | path; a pad name or v marks a point on that pad's centre or on a via)
66.3VAC/1
  Bottom 2.54: 101.1,64.88 101.1,75.26 arc45 98.17,82.33 92.46,88.04 arc45 88.93,89.5 83.07,89.5 arc-45 79.54,90.96 68.46,102.04 arc45 64.93,103.5 50.32,103.5 arc45 46.79,102.04 J1.1 41.82,100.25 arc45 38.29,98.79 30.46,90.96 arc-45 26.93,89.5 21.07,89.5 arc45 17.54,88.04 11.83,82.33 arc45 8.9,75.26 | SX2.4 93.1,27.43 arc90 98.1,32.43 98.1,34.57 arc45 97.51,35.99 97.29,36.21 arc-45 96.7,37.63 96.7,40.7 arc-45 98.16,44.23 104.27,50.34 arc45 105.73,53.87 105.73,54.7 arc45 104.27,58.23 102.56,59.94 arc-45 101.1,63.47 101.1,64.88 | SX4.4 101.1,64.88 | SX1.4 arc-45 15.28,40.79 5.73,50.34 arc-45 4.27,53.87 4.27,54.7 arc-45 5.73,58.23 7.44,59.94 arc45 8.9,63.47 8.9,75.26 | 8.9,75.26 arc-90 10.86,77.22 SX3.4
66.3VAC/2
  Bottom 2.54: 63.57,71.05 63.57,89.5 arc90 58.57,94.5 57.82,94.5 arc-45 54.29,95.96 J1.2 47.9,98.14 arc45 46.43,94.61 46.43,60.5 | 46.43,60.5 46.43,31.31 arc-135 41.31,29.19 38.36,32.14 arc45 34.83,33.6 SX1.5 | 63.57,71.05 63.57,31.31 arc135 68.69,29.19 71.64,32.14 arc-45 75.17,33.6 SX2.5 | SX4.5 63.57,71.05 | 46.43,60.5 32.87,60.5 arc-45 29.34,61.96 21.72,69.58 arc45 18.18,71.05 SX3.5
+240VDC
  Top 2.54: J1.5 56.46,91.71 arc45 55,88.18 55,70.25 | 55,70.25 C3.1 41.47,56.72 arc-45 R6.2 | 55,70.25 C4.1 68.53,56.72 arc45 R12.2 | 55,37.5 C1.1 49.46,31.96 arc45 48,28.43 48,20.74 arc-135 41.46,18.04 arc45 37.93,19.5 15.07,19.5 arc-45 11.54,20.96 R17.1 | 55,70.25 55,37.5 | 55,37.5 C2.1 60.54,31.96 arc-45 62,28.43 62,20.74 arc135 68.54,18.04 arc-45 72.07,19.5 94.93,19.5 arc45 98.46,20.96 R18.2
  Bottom 2.54: R12.2 R11.2 | R6.2 R5.2
AGND
  pour Bottom (rank 6, no thermals): 0,0 110,0 110,105.3 0,105.3
  pour Top (rank 6, no thermals): 0,0 110,0 110,105.3 0,105.3
L+
  Top 1.27: R23O.1 87.08,85.56 arc45 90.61,84.1 95.69,84.1 arc-45 99.23,82.64 R24O.1 103.5,78.07 arc45 104.96,74.54 arc-45 105.73,72.68 105.73,68.25 arc-45 104.27,64.72 R4.2
L-
  Top 1.27: R3.2 71.61,74.74 arc-45 70.14,71.21 R26O.1
  Bottom 1.27: R25O.1 88.61,85.56 arc-45 85.07,84.1 79.42,84.1 arc45 75.88,82.64 R3.2
L_OUT
  Top 1.27: C21O1.1 67.92,9.5 arc-45 64.39,10.96 58.86,16.49 arc-45 57.4,20.02 J3.2
N$1
  Top 1.27: R7.2 R6.1 25.92,55.7 arc90 30.92,60.7 SX3.9
N$2
  Top 1.27: R8.1 43.6,22.75 arc45 45.06,26.28 45.06,44.68 arc45 43.6,48.22 Z3.2
  Bottom 1.27: SX1.2 35.35,43.59 arc45 38.89,45.05 Z3.2
N$3
  Top 1.27: C21O1.2 97.85,9 arc45 101.39,7.54 D6.1 | SX2.8 80.53,34.75 arc-45 79.07,31.21 SX2.1
  Bottom 1.27: SX2.1 78.78,27.43 arc-90 83.78,22.43 83.78,14.5 arc90 88.78,9.5 C21O1.2
N$4
  Top 1.27: SX4.2 84.33,63.2 arc90 79.33,68.2 R3.1 72.3,67.51 arc-45 73.76,63.98 73.76,55.8 arc-90 70.76,52.8 68.22,52.8 arc-45 D4.2
N$5
  Top 1.27: SX4.7 94.89,81.03 arc-45 98.43,79.57 99.54,78.46 arc-45 101,74.93 101,62.16 arc45 102.03,59.66 arc-45 103.5,56.13 R4.1
  Bottom 1.27: SX4.7 85.35,75.56 arc-45 81.81,74.1 74.37,74.1 arc-90 69.37,79.1 69.37,89.01 arc-45 70.84,92.55 D5.2
N$6
  Top 1.27: SX3.2 30.1,81.03 arc-90 35.1,76.03 35.1,73.53 arc45 36.56,69.99 R1.1 37.66,67.51 arc45 36.2,63.98 36.2,55.8 arc90 39.2,52.8 41.75,52.8 arc45 D1.2
N$7
  Top 2.54: D5.1 70.19,84.04 arc45 66.66,85.5 arc90 64,82.84 64,69.16 arc45 65.46,65.62 D4.1 | SX4.6 92.28,73.44 arc45 90.82,69.9 SX4.3 arc45 91.83,58.62 96.42,54.03 arc45 99.03,52.95 arc-45 101.59,51.89 102.46,51.02 arc-45 U2.3
  Bottom 2.54: SX4.3 88.12,63.76 arc90 82.46,63.76 80.98,62.28 arc-45 78.86,61.4 71.76,61.4 arc-45 68.22,62.86 D4.1
N$8
  Top 1.27: SX4.1 79.08,59.44 arc45 80.54,55.9 R11.1
N$9
  Top 1.27: R13.2 R12.1 arc45 87.57,58.91 87.57,66.66 arc45 86.11,70.19 SX4.9
N$10
  Top 1.27: J13.6 C11O.1
N$11
  Top 1.27: C11O.2 arc45 4.27,98.06 4.27,79.51 arc-45 2.8,75.97 arc45 2.03,74.11 R19O.2
  Bottom 1.27: R19O.2 R12O.2
N$12
  Top 1.27: J2.6 C15O.1
N$13  (via drill 0.35)
  Top 1.27: SX3.7 20.84,62.72 arc45 22.3,66.25 22.3,79.93 arc-45 23.76,83.46 25.26,84.96 arc45 v25.9,86.5
  Bottom 1.27: SX3.7 14.85,61.06 arc45 11.31,59.6 7.21,55.49 arc45 R2.1 | v25.9,86.5 27.39,86.5 arc45 34.46,89.43 D2.2
N$14
  Top 1.27: R14.1 66.36,22.75 arc-45 64.9,26.28 64.9,44.68 arc-45 66.36,48.22 Z4.2
  Bottom 1.27: R14.1 76.82,21.97 arc45 80.35,23.44 SX2.2
N$15
  Top 1.27: J13.1 C12O.1
N$16
  Top 1.27: C2O.2 8.61,41.04 arc-45 12.15,42.5 arc45 13.6,43.1 20.55,50.05 R3O.1 21.89,48.86 arc45 25.43,47.4 29.93,47.4 arc-45 33.46,45.94 37.54,41.86 arc-45 39,38.33 39,38.03 arc45 40.46,34.49 R8.2
N$17
  Top 1.27: C2O1.2 93.69,48.74 arc45 90.15,50.2 R3O1.1
  Bottom 1.27: R14.2 69.54,34.53 arc45 71,38.06 71,39.43 arc-45 72.46,42.96 75.54,46.04 arc-45 79.07,47.5 84.67,47.5 arc45 88.21,48.96 R3O1.1
N$18
  Top 1.27: D3.1 8.61,7.54 arc45 12.15,9 C21O.2 | SX1.1 30.93,35.99 arc45 29.47,32.45 SX1.8
  Bottom 1.27: C21O.2 13.28,9.5 arc45 16.82,10.96 SX1.8
N$19
  Top 1.27: C12O.2 34.61,98.92 arc-45 38.14,97.46 R20O.1 37.91,87.86 arc-45 34.37,86.4 R18O.2
N$20
  Top 1.27: C15O.2 arc-45 105.73,98.06 105.73,79.51 arc45 107.2,75.97 arc-45 107.97,74.11 R28O.2
  Bottom 1.27: R24O.2 R28O.2
N$21
  Top 1.27: J13.4 18.12,102.38 arc-45 16.65,98.85 C13O.1
N$22
  Top 2.54: D2.1 39.77,84.04 arc-45 43.31,85.5 arc-90 46,82.81 46,69.19 arc-45 44.54,65.66 D1.1 | SX3.3 19.18,72.2 arc-45 17.72,68.66 SX3.6 13.93,51.38 arc-45 12.47,47.84 11.62,46.99 arc-45 10.91,46.7 10.74,46.7 arc45 10.03,46.41 U1.3
  Bottom 2.54: SX3.3 24.95,75.26 arc45 28.49,73.8 36.08,73.8 arc90 40.59,78.31 arc45 39.13,81.84 D2.1
N$23
  Bottom 1.27: SX1.7 19.06,19.7 arc-45 15.53,18.23 D3.2 6.5,27.03 arc-45 7.96,30.57 12.64,35.24 arc-45 16.17,36.7 18.52,36.7 arc90 21.4,39.58 arc45 20.46,41.84 arc-45 19,45.37 arc45 17.78,48.31 R7.1
N$24
  Top 1.27: J13.3 20.66,102.38 arc45 22.12,98.85 C14O.1
N$25
  Top 1.27: R11O.1 6.79,93.07 arc-45 10.32,94.53 20.87,94.53 arc-45 24.4,93.07 C14O.2 36.1,81.36 arc45 38.92,80.2 arc-45 42.45,78.74 R16O.2
N$26
  Top 1.27: SX1.3 22.98,30.15 arc-45 21.51,26.61 20.06,25.16 arc-90 13.04,25.16 arc90 5.96,25.16 3.5,22.7 arc45 2.03,19.16 R9.2
  Bottom 1.27: Z3.1 32.25,36.39 arc-45 28.71,37.85 SX1.3
N$27
  Top 1.27: SX2.3 84.4,26.24 arc90 78.74,26.24 77.83,25.33 arc-90 72.17,25.33 arc-45 71,28.16 71,30.46 arc45 69.54,33.99 Z4.1
  Bottom 1.27: SX2.3 95.08,23.61 arc45 96.85,24.35 97.27,24.77 arc-45 99.04,25.5 102.97,25.5 arc-90 107.97,20.5 R15.2
N$28
  Top 1.27: C13O.2 11.86,90.56 arc45 10.39,87.02 R14O.2
  Bottom 1.27: R21O.2 7.01,87.8 arc45 R14O.2
N$29
  Top 1.27: D6.2 103.5,22.93 arc45 102.03,26.46 99.45,29.05 arc45 95.91,30.52 92.02,30.52 arc-90 87.02,35.52 SX2.7
  Bottom 1.27: SX2.7 arc45 87.83,43.92 R13.1
N$30
  Top 1.27: C24O.1 J2.1
N$31
  Top 1.27: C24O.2 75.36,98.92 arc45 71.82,97.46 R29O.1 72.06,87.86 arc45 75.59,86.4 R23O.2
N$32
  Top 1.27: J2.4 91.88,102.38 arc45 93.35,98.85 C25O.1
N$33
  Top 1.27: J2.3 89.34,102.38 arc-45 87.88,98.85 C26O.1
N$34
  Top 1.27: R22O.1 103.21,93.07 arc45 99.68,94.53 89.13,94.53 arc45 85.6,93.07 C26O.2 73.92,81.39 arc-45 71.05,80.2 arc45 67.51,78.74 R26O.2
N$35
  Top 1.27: SX3.1 30.92,72.65 arc45 32.39,69.11 32.54,68.96 arc-45 34,65.43 34,57.57 arc-45 32.54,54.04 30.17,51.67 arc-45 26.63,50.2 R5.1
N$36
  Top 1.27: C25O.2 98.14,90.56 arc-45 99.61,87.02 R25O.2
  Bottom 1.27: R30O.2 102.99,87.8 arc-45 R25O.2
N$37
  Top 1.27: U1.2 U1.4 arc45 3.62,52.2 R10.2
N$38
  Top 1.27: U2.4 U2.2 arc-45 106.38,52.2 R16.2
N$39
  Top 2.54: R17.2 9.62,34.55 | C2O.1 9.62,34.55 | 9.62,34.55 16.04,28.13 arc45 SX1.6
N$40
  Top 2.54: C2O1.1 101.84,33.08 arc-45 100.38,36.62 R18.1 100.19,38.31 arc45 96.65,39.77 SX2.6
R+
  Top 1.27: R18O.1 22.92,85.56 arc-45 19.39,84.1 14.31,84.1 arc45 10.77,82.64 R12O.1 6.5,78.07 arc-45 5.04,74.54 arc45 4.27,72.68 4.27,68.25 arc45 5.73,64.72 R2.2
R-
  Top 1.27: R1.2 38.35,74.74 arc45 39.82,71.21 R16O.1
  Bottom 1.27: R14O.1 21.39,85.56 arc45 24.93,84.1 30.55,84.1 arc-45 34.08,82.64 R1.2
R_OUT
  Top 1.27: C21O.1 42.08,9.5 arc45 45.61,10.96 51.14,16.49 arc45 52.6,20.02 J3.3